# Altium schematic sheet 03 POWER.SchDoc: POWER
size 420 x 297 mm; SheetNumber: 2; SheetTotal: 7
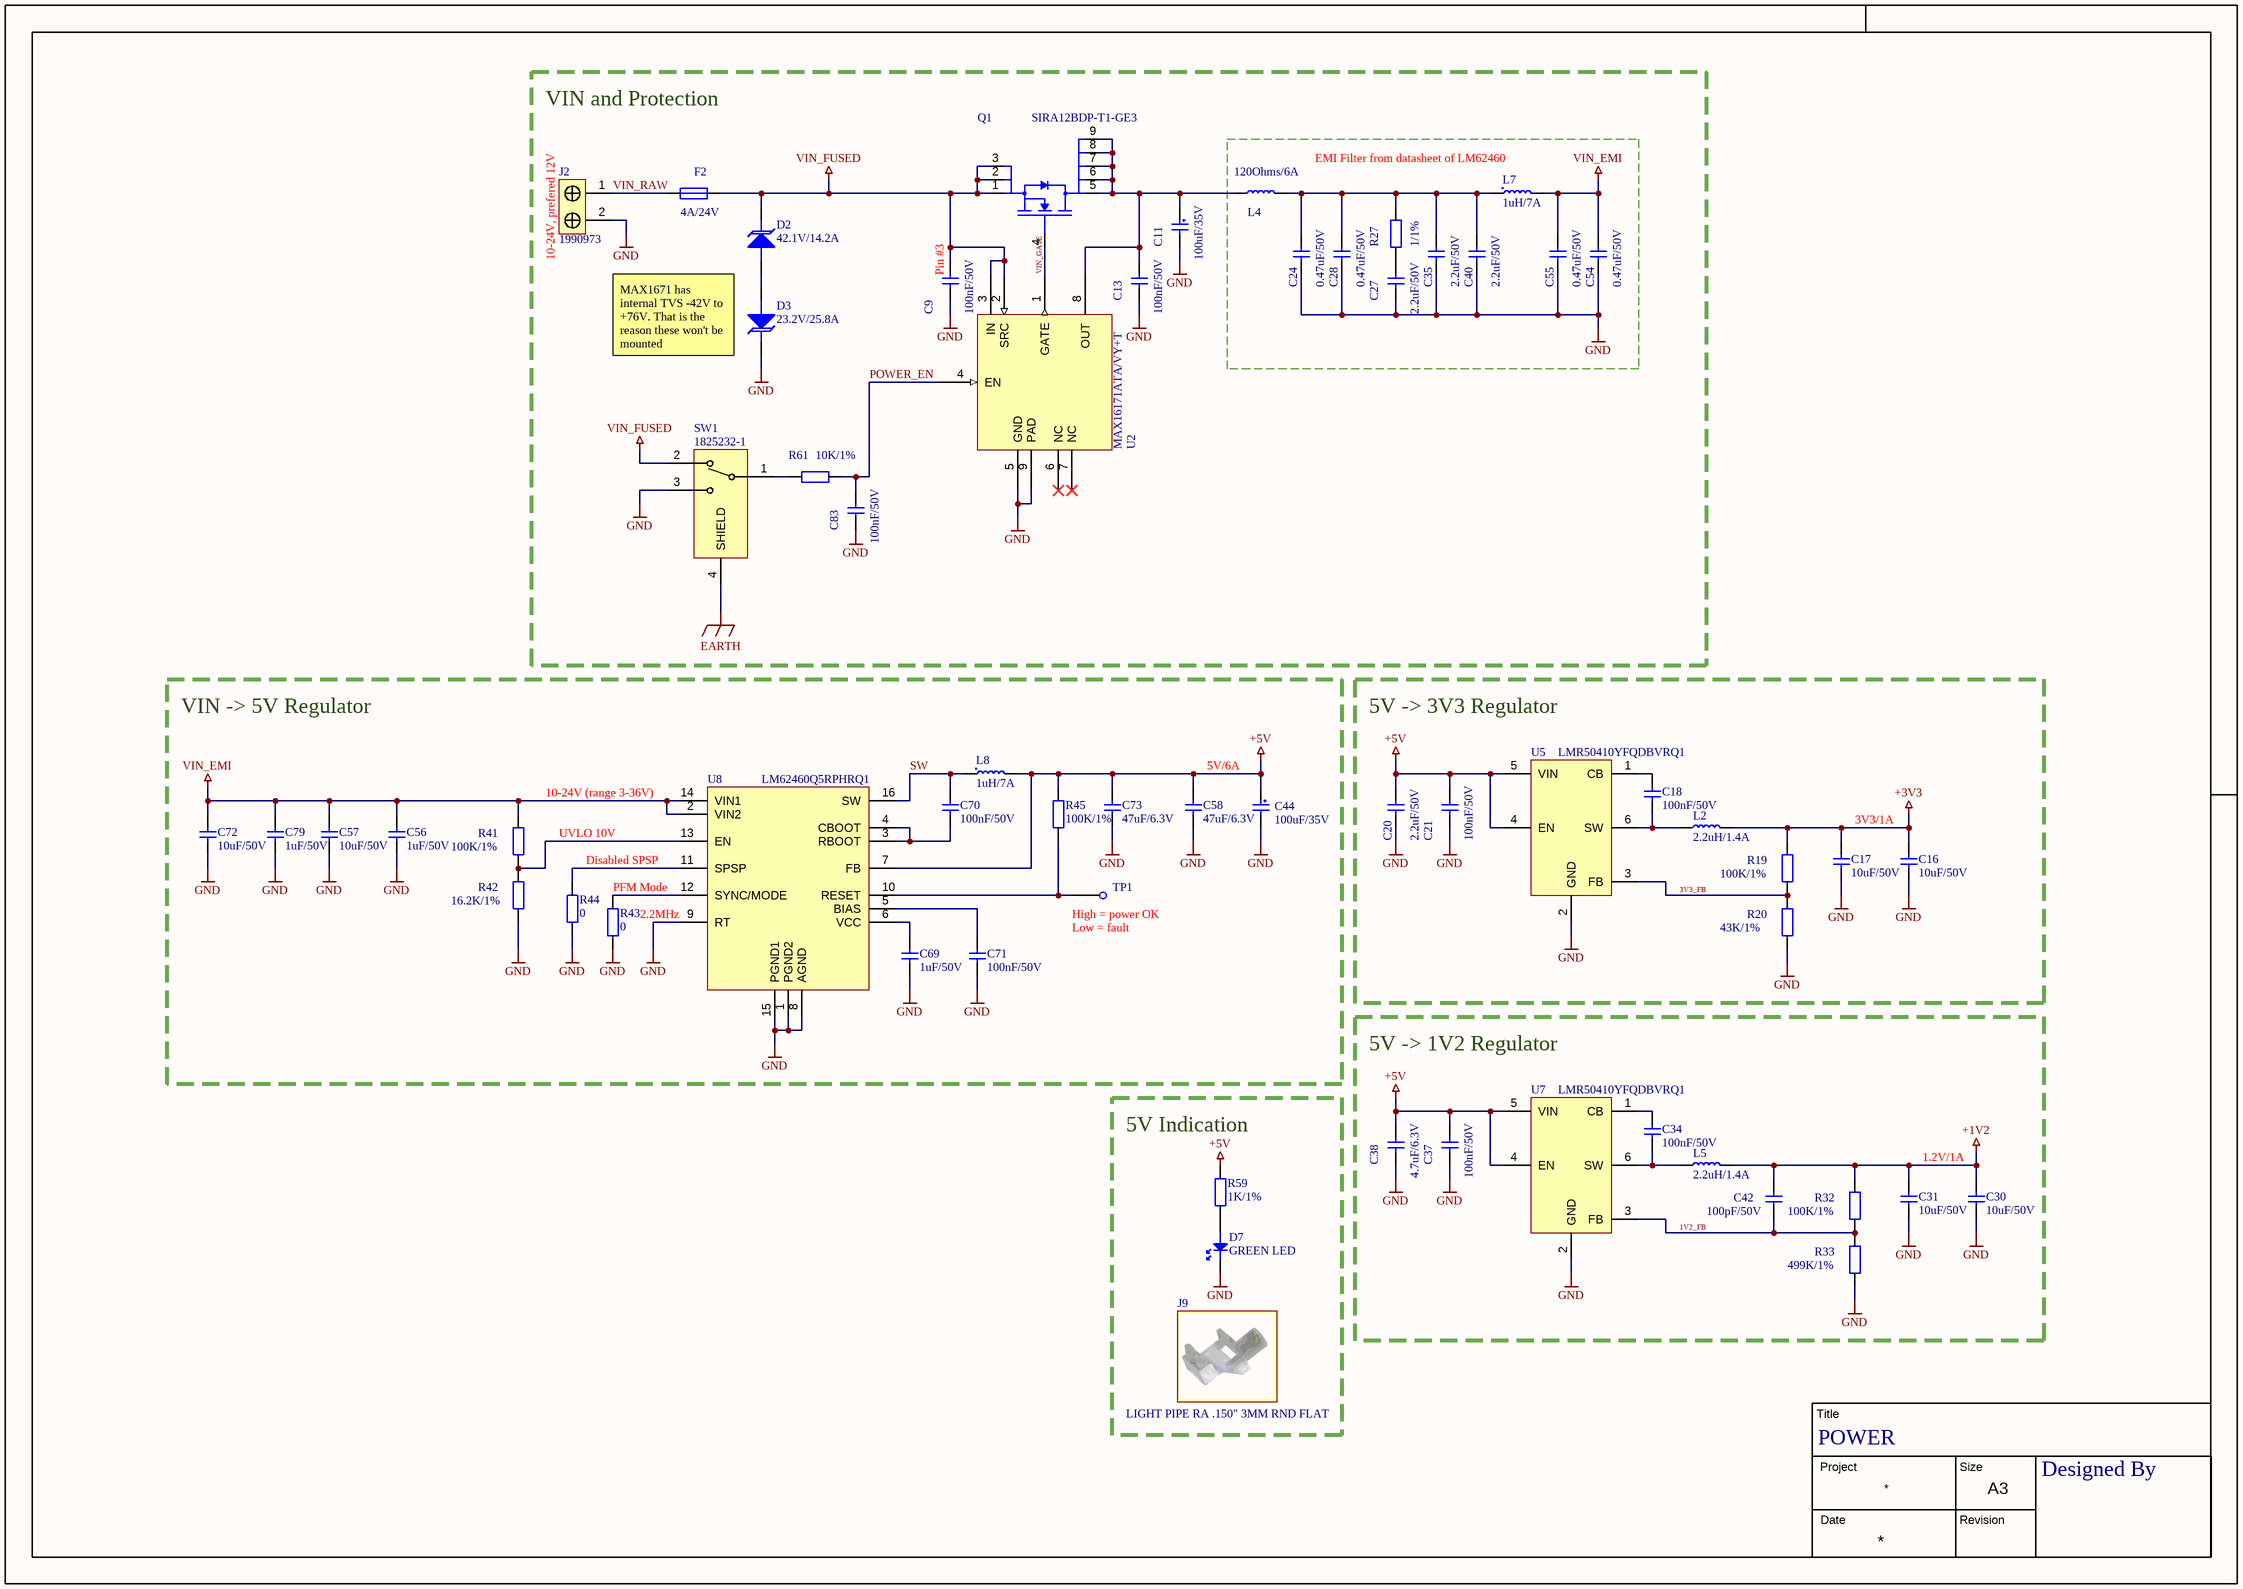
[diagram p0: 03 POWER.SchDoc]

## Parts
C9  100nF/50V  [CAPC1005X06N]
C11  100uF/35V  [CAPAE11580X70M]
C13  100nF/50V  [CAPC1005X06N]
C16  10uF/50V  [CAPC3216X18N]
C17  10uF/50V  [CAPC3216X18N]
C18  100nF/50V  [CAPC1005X06N]
C20  2.2uF/50V  [INDC1608X10N]
C21  100nF/50V  [CAPC1005X06N]
C24  0.47uF/50V  [INDC1608X10N]
C27  2.2uF/50V  [INDC1608X10N]
C28  0.47uF/50V  [INDC1608X10N]
C30  10uF/50V  [CAPC3216X18N]
C31  10uF/50V  [CAPC3216X18N]
C34  100nF/50V  [CAPC1005X06N]
C35  2.2uF/50V  [INDC1608X10N]
C37  100nF/50V  [CAPC1005X06N]
C38  4.7uF/6.3V  [CAPC1005X06N]
C40  2.2uF/50V  [INDC1608X10N]
C42  100pF/50V  [CAPC1005X06N]
C44  100uF/35V  [CAPAE11580X70M]
C54  0.47uF/50V  [INDC1608X10N]
C55  0.47uF/50V  [INDC1608X10N]
C56  1uF/50V  [INDC1608X10N]
C57  10uF/50V  [CAPC3216X18N]
C58  47uF/6.3V  [INDC1608X10N]
C69  1uF/50V  [INDC1608X10N]
C70  100nF/50V  [CAPC1005X06N]
C71  100nF/50V  [CAPC1005X06N]
C72  10uF/50V  [CAPC3216X18N]
C73  47uF/6.3V  [INDC1608X10N]
C79  1uF/50V  [INDC1608X10N]
C83  100nF/50V  [CAPC1005X06N]
D2  42.1V/14.2A  [DIOM4739X26N]
D3  23.2V/25.8A  [DIOM4739X26N]
D7  GREEN LED  [DIOC1608X06L]
F2  4A/24V  [INDC7451X08N]
J2  1990973  [1990973]
J9  LIGHT PIPE RA .150" 3MM RND FLAT  [SLP3-150-150-F]
L2  2.2uH/1.4A  [INDP2016X12N]
L4  120Ohms/6A  [INDC3216X18N]
L5  2.2uH/1.4A  [INDP2016X12N]
L7  1uH/7A  [INDP5752X20N]  (net tie)
L8  1uH/7A  [INDP5752X20N]  (net tie)
Q1  SIRA12BDP-T1-GE3  [POWERPAK-SO-8-Single]
R19  100K/1%  [RESC1005X04N]
R20  43K/1%  [RESC1005X04N]
R27  1/1%  [RESC1608X04N]
R32  100K/1%  [RESC1005X04N]
R33  499K/1%  [RESC1005X04N]
R41  100K/1%  [RESC1005X04N]
R42  16.2K/1%  [RESC1005X04N]
R43  0  [RESC1005X04N]
R44  0  [RESC1005X04N]
R45  100K/1%  [RESC1005X04N]
R59  1K/1%  [RESC1005X04N]
R61  10K/1%  [RESC1005X04N]
SW1  1825232-1  [1825232-1]
TP1  Test Point 1mm  [TEST_POINT_1mm]  (value not drawn)
U2  MAX16171ATA/VY+T  [PSON50P300X80_HS-9N]
U5  LMR50410YFQDBVRQ1  [SOT95P280X145-6N]
U7  LMR50410YFQDBVRQ1  [SOT95P280X145-6N]
U8  LM62460Q5RPHRQ1  [VQFN-HR]

## Blocks framed on the sheet
VIN and Protection: C9 C11 C13 C83 D2 D3 F2 J2 Q1 R61 SW1 U2
EMI Filter from datasheet of LM62460: C24 C27 C28 C35 C40 C54 C55 L4 L7 R27
VIN -> 5V Regulator: C44 C56-C58 C69-C73 C79 L8 R41-R45 TP1 U8
5V -> 3V3 Regulator: C16-C18 C20 C21 L2 R19 R20 U5
5V -> 1V2 Regulator: C30 C31 C34 C37 C38 C42 L5 R32 R33 U7
5V Indication: D7 J9 R59

## Nets
+1V2: C30.2 C31.2 C42.2 L5.2 R32.2
+3V3: C16.2 C17.2 L2.2 R19.2
+5V: C20.2 C21.2 C37.2 C38.2 C44.1 C58.2 C73.2 L8.2 R45.1 R59.2 U5.4(EN) U5.5(VIN) U7.4(EN) U7.5(VIN) U8.7(FB)
EARTH: SW1.4(SHIELD)
GND: C9.1 C11.2 C13.1 C16.1 C17.1 C20.1 C21.1 C24.1 C27.1 C28.1 C30.1 C31.1 C35.1 C37.1 C38.1 C40.1 C44.2 C54.1 C55.1 C56.1 C57.1 C58.1 C69.1 C71.1 C72.1 C73.1 C79.1 C83.1 D3.1 D7.1 J2.2 R20.1 R33.1 R42.1 R43.1 R44.1 SW1.3 U2.5(GND) U2.9(PAD) U5.2(GND) U7.2(GND) U8.1(PGND2) U8.8(AGND) U8.9(RT) U8.15(PGND1)
VIN_EMI: C54.2 C55.2 C56.2 C57.2 C72.2 C79.2 L7.2 R41.2 U8.2(VIN2) U8.14(VIN1)
VIN_FUSED: C9.2 D2.1 F2.2 Q1.1 Q1.2 Q1.3 SW1.2 U2.2(SRC) U2.3(IN)
1V2_FB: C42.1 R32.1 R33.2 U7.3(FB)
3V3_FB: R19.1 R20.2 U5.3(FB)
POWER_EN: C83.2 R61.2 U2.4(EN)
SW: C70.2 L8.1 U8.16(SW)
VIN_GATE: Q1.4 U2.1(GATE)
VIN_RAW: F2.1 J2.1
NetC11_1: C11.1 C13.2 L4.1 Q1.5 Q1.6 Q1.7 Q1.8 Q1.9 U2.8(OUT)
NetC18_1: C18.1 L2.1 U5.6(SW)
NetC18_2: C18.2 U5.1(CB)
NetC24_2: C24.2 C28.2 C35.2 C40.2 L4.2 L7.1 R27.2
NetC27_2: C27.2 R27.1
NetC34_1: C34.1 L5.1 U7.6(SW)
NetC34_2: C34.2 U7.1(CB)
NetC69_2: C69.2 U8.6(VCC)
NetC70_1: C70.1 U8.3(RBOOT) U8.4(CBOOT)
NetC71_2: C71.2 U8.5(BIAS)
NetD2_2: D2.2 D3.2
NetD7_2: D7.2 R59.1
NetR41_1: R41.1 R42.2 U8.13(EN)
NetR43_2: R43.2 U8.12(SYNC/MODE)
NetR44_2: R44.2 U8.11(SPSP)
NetR45_2: R45.2 TP1.1 U8.10(RESET)
NetR61_1: R61.1 SW1.1

Not connected (* = marked no-connect by the designer): U2 6(NC)* 7(NC)*

## Notes on the sheet
- (near J2) 10-24V, prefered 12V
- (near C9) Pin #3
- MAX1671 has internal TVS -42V to +76V. That is the reason these won't be mounted
- 10-24V (range 3-36V)
- 5V/6A
- UVLO 10V
- Disabled SPSP
- 3V3/1A
- (near R43) PFM Mode
- 2.2MHz
- (near TP1) High = power OK
- (near TP1) Low = fault
- 1.2V/1A
- Title
- Project
- Size
- Date
- Revision
- A3
- Designed By

## Library data of the parts
C9 C13 C18 C21 C34 C37 C70 C71 C83 = GCM155R71H104KE02J: 0.1 µF ±10% 50V Ceramic Capacitor X7R 0402 (1005 Metric); manufacturer: Murata Electronics; mfr_part_number: GCM155R71H104KE02J; assembler_number: GCM155R71H104KE02J; datasheet: https://search.murata.co.jp/Ceramy/image/img/A01X/G101/ENG/GCM155R71H104KE02-01.pdf
C11 C44 = A769KE107M1VLAS031: 100 µF 35 V Aluminum - Polymer Capacitors Radial, Can - SMD 2000 Hrs @ 125°C; manufacturer: KEMET; mfr_part_number: A769KE107M1VLAS031; assembler_number: A769KE107M1VLAS031; datasheet: https://connect.kemet.com:7667/gateway/IntelliData-ComponentDocumentation/1.0/download/datasheet/A769KE107M1VLAS031
C16 C17 C30 C31 C57 C72 = GRT31CR61H106ME01L: 10 µF ±20% 50V Ceramic Capacitor X5R 1206 (3216 Metric); manufacturer: Murata Electronics; mfr_part_number: GRT31CR61H106ME01L; assembler_number: GRT31CR61H106ME01L; datasheet: https://search.murata.co.jp/Ceramy/image/img/A01X/G101/ENG/GRT31CR61H106ME01-01.pdf
C20 C27 C35 C40 = GRT188R61H225ME13D: 2.2 µF ±20% 50V Ceramic Capacitor X5R 0603 (1608 Metric); manufacturer: Murata Electronics; mfr_part_number: GRT188R61H225ME13D; assembler_number: GRT188R61H225ME13D; datasheet: https://search.murata.co.jp/Ceramy/image/img/A01X/G101/ENG/GRT188R61H225ME13-01.pdf
C24 C28 C54 C55 = CGA3E3X7R1H474K080AB: 0.47 µF ±10% 50V Ceramic Capacitor X7R 0603 (1608 Metric); manufacturer: TDK Corporation; mfr_part_number: CGA3E3X7R1H474K080AB; assembler_number: CGA3E3X7R1H474K080AB; datasheet: https://product.tdk.com/system/files/dam/doc/product/capacitor/ceramic/mlcc/catalog/mlcc_automotive_general_en.pdf
C38 = JMK105BBJ475MVHF: 4.7 µF ±20% 6.3V Ceramic Capacitor X5R 0402 (1005 Metric); manufacturer: Taiyo Yuden; mfr_part_number: JMK105BBJ475MVHF; assembler_number: JMK105BBJ475MVHF; datasheet: https://media.digikey.com/pdf/Data%20Sheets/Taiyo%20Yuden%20PDFs%20URL%20links/JMK105BBJ475MVHF_SS.pdf
C42 = GCM1555C1H101JA16D: 100 pF ±5% 50V Ceramic Capacitor C0G, NP0 0402 (1005 Metric); manufacturer: Murata Electronics; mfr_part_number: GCM1555C1H101JA16D; assembler_number: GCM1555C1H101JA16D; datasheet: https://www.murata.com/-/media/webrenewal/support/library/catalog/products/k35e.ashx?la=en-us&cvid=20200508021757000000
C56 C69 C79 = GRT188R61H105KE13D: 1 µF ±10% 50V Ceramic Capacitor X5R 0603 (1608 Metric); manufacturer: Murata Electronics; mfr_part_number: GRT188R61H105KE13D; assembler_number: GRT188R61H105KE13D; datasheet: https://search.murata.co.jp/Ceramy/image/img/A01X/G101/ENG/GRT188R61H105KE13-01.pdf
C58 C73 = GRM188R60J476ME15D: 47 µF ±20% 6.3V Ceramic Capacitor X5R 0603 (1608 Metric); manufacturer: Murata Electronics; mfr_part_number: GRM188R60J476ME15D; assembler_number: GRM188R60J476ME15D; datasheet: https://search.murata.co.jp/Ceramy/image/img/A01X/G101/ENG/GRM188R60J476ME15-01.pdf
D2 = SMBJ26A-13-F: 42.1V Clamp 14.2A Ipp Tvs Diode Surface Mount SMB; manufacturer: Diodes Incorporated; mfr_part_number: SMBJ26A-13-F; assembler_number: SMBJ26A-13-F; datasheet: https://www.diodes.com/assets/Datasheets/ds19002.pdf
D3 = SMBJ14A-13-F: 23.2V Clamp 25.8A Ipp Tvs Diode Surface Mount SMB; manufacturer: Diodes Incorporated; mfr_part_number: SMBJ14A-13-F; assembler_number: SMBJ14A-13-F; datasheet: https://www.diodes.com/assets/Datasheets/ds19002.pdf
D7 = LTST-C191KGKT: White 0402 Light Emitting Diodes (LED) RoHS; manufacturer: Lite-On Inc.; mfr_part_number: LTST-C191KGKT; assembler_number: LTST-C191KGKT; datasheet: https://optoelectronics.liteon.com/upload/download/DS22-2000-228/LTST-C191KGKT.PDF
F2 = 0ZCF0200AF2C: Polymeric PTC Resettable Fuse 24V 2 A Ih Surface Mount 2920 (7351 Metric), Concave - 4A trip; manufacturer: Bel Fuse Inc.; mfr_part_number: 0ZCF0200AF2C; assembler_number: 0ZCF0200AF2C; datasheet: https://www.belfuse.com/resources/datasheets/circuitprotection/ds-cp-0zcf-series.pdf
J2 = 1990973: 2 Position Wire to Board Terminal Block Horizontal with Board 0.197" (5.00mm) Through Hole; manufacturer: Phoenix Contact; mfr_part_number: 1990973; assembler_number: 1990973; datasheet: https://www.phoenixcontact.com/en-pc/products/pcb-terminal-block-spt-25-2-h-50-1990973
J9 = SLP3-150-150-F: Light Pipe Single Clear Rigid Board Mount, Press Fit, Right Angle; manufacturer: Bivar Inc.; mfr_part_number: SLP3-150-150-F; assembler_number: SLP3-150-150-F; datasheet: https://www.bivar.com/parts_content/Datasheets/SLP3-150-XXX-X.pdf
L2 L5 = TYA2016102R2M-10: 2.2 µH Shielded Drum Core, Wirewound Inductor 1.4 A 180mOhm Max 0806 (2016 Metric); manufacturer: Laird-Signal Integrity Products; mfr_part_number: TYA2016102R2M-10; assembler_number: TYA2016102R2M-10; datasheet: https://www.laird.com/sites/default/files/tya201610-series-datasheet.pdf
L4 = BLM31KN121SN1L: 120 Ohms @ 100 MHz 1 Power Line Ferrite Bead 1206 (3216 Metric) 6A 9mOhm; manufacturer: Murata Electronics; mfr_part_number: BLM31KN121SN1L; assembler_number: BLM31KN121SN1L; datasheet: https://www.murata.com/en-us/products/productdata/8801529331742/ENFA0091.pdf
L7 L8 = SRP5020TA-1R0M: 1 µH Shielded Drum Core, Wirewound Inductor 7 A 20mOhm Max Nonstandard; manufacturer: Bourns Inc.; mfr_part_number: SRP5020TA-1R0M; assembler_number: SRP5020TA-1R0M; datasheet: https://www.bourns.com/docs/Product-Datasheets/SRP5020TA.pdf
Q1 = SIRA12BDP-T1-GE3: N-Channel 30 V 27A (Ta), 60A (Tc) 5W (Ta), 38W (Tc) Surface Mount PowerPAK® SO-8; manufacturer: Vishay Siliconix; mfr_part_number: SIRA12BDP-T1-GE3; assembler_number: SIRA12BDP-T1-GE3; datasheet: https://www.vishay.com/docs/76390/sira12bdp.pdf
R19 R32 R41 R45 = RMCF0402FT100K: 100 kOhms ±1% 0.063W, 1/16W Chip Resistor 0402 (1005 Metric) Automotive AEC-Q200 Thick Film; manufacturer: Stackpole Electronics Inc; mfr_part_number: RMCF0402FT100K; assembler_number: RMCF0402FT100K; datasheet: https://www.seielect.com/Catalog/SEI-RMCF_RMCP.pdf
R20 = ERJ-2RKF4302X: 43 kOhms ±1% 0.1W, 1/10W Chip Resistor 0402 (1005 Metric) Automotive AEC-Q200 Thick Film; manufacturer: Panasonic Electronic Components; mfr_part_number: ERJ-2RKF4302X; assembler_number: ERJ-2RKF4302X; datasheet: https://industrial.panasonic.com/cdbs/www-data/pdf/RDA0000/AOA0000C304.pdf
R27 = RMCF0603FT1R00: 1 Ohms ±1% 0.1W, 1/10W Chip Resistor 0603 (1608 Metric) Automotive AEC-Q200 Thick Film; manufacturer: Stackpole Electronics Inc; mfr_part_number: RMCF0603FT1R00; assembler_number: RMCF0603FT1R00; datasheet: https://www.seielect.com/Catalog/SEI-RMCF_RMCP.pdf
R33 = RMCF0402FT499K: 499 kOhms ±1% 0.063W, 1/16W Chip Resistor 0402 (1005 Metric) Automotive AEC-Q200 Thick Film; manufacturer: Stackpole Electronics Inc; mfr_part_number: RMCF0402FT499K; assembler_number: RMCF0402FT499K; datasheet: https://www.seielect.com/Catalog/SEI-RMCF_RMCP.pdf
R42 = ERJ-2RKF1622X: 16.2 kOhms ±1% 0.1W, 1/10W Chip Resistor 0402 (1005 Metric) Automotive AEC-Q200 Thick Film; manufacturer: Panasonic Electronic Components; mfr_part_number: ERJ-2RKF1622X; assembler_number: ERJ-2RKF1622X; datasheet: https://industrial.panasonic.com/cdbs/www-data/pdf/RDA0000/AOA0000C304.pdf
R43 R44 = 0402WGF0000TCE: 62.5mW Thick Film Resistors 50V ±800ppm/℃ ±1% -55℃~+155℃ 0Ω 0402  Chip Resistor - Surface Mount ROHS; manufacturer: UNI-ROYAL(Uniroyal Elec); assembler_number: C17168; mfr_part_number: 0402WGF0000TCE; datasheet: https://datasheet.lcsc.com/lcsc/2206010216_UNI-ROYAL-Uniroyal-Elec-0402WGF0000TCE_C17168.pdf
R59 = RMCF0402FT1K00: 1 kOhms ±1% 0.063W, 1/16W Chip Resistor 0402 (1005 Metric) Automotive AEC-Q200 Thick Film; manufacturer: Stackpole Electronics Inc; mfr_part_number: RMCF0402FT1K00; assembler_number: RMCF0402FT1K00; datasheet: https://www.seielect.com/Catalog/SEI-RMCF_RMCP.pdf
R61 = RMCF0402FT10K0: 10 kOhms ±1% 0.063W, 1/16W Chip Resistor 0402 (1005 Metric) Automotive AEC-Q200 Thick Film; manufacturer: Stackpole Electronics Inc; mfr_part_number: RMCF0402FT10K0; assembler_number: RMCF0402FT10K0; datasheet: https://www.seielect.com/Catalog/SEI-RMCF_RMCP.pdf
SW1 = 1825232-1: Slide Switch SPDT Through Hole, Right Angle; manufacturer: TE Connectivity ALCOSWITCH Switches; mfr_part_number: 1825232-1; assembler_number: 1825232-1; datasheet: https://www.te.com/commerce/DocumentDelivery/DDEController?Action=srchrtrv&DocNm=1825232&DocType=Customer+Drawing&DocLang=English&DocFormat=pdf&PartCntxt=1825232-1
TP1 = TestPoint
U2 = MAX16171ATA/VY+T: OR Controller N+1 ORing Controller N-Channel 1:1 8-TDFN-CU (2x3); manufacturer: Analog Devices Inc./Maxim Integrated; mfr_part_number: MAX16171ATA/VY+T; assembler_number: MAX16171ATA/VY+T; datasheet: https://datasheets.maximintegrated.com/en/ds/MAX16171.pdf
U5 U7 = LMR50410YFQDBVRQ1: Buck Switching Regulator IC Positive Adjustable 1V 1 Output 1A SOT-23-6; manufacturer: Texas Instruments; mfr_part_number: LMR50410YFQDBVRQ1; assembler_number: LMR50410YFQDBVRQ1; datasheet: https://www.ti.com/lit/ds/symlink/lmr50410-q1.pdf
U8 = LM62460Q5RPHRQ1: Switching Voltage Regulators 6-A automotive buck converter optimized for power density and low EMI; manufacturer: Texas Instruments; mfr_part_number: LM62460Q5RPHRQ1; assembler_number: LM62460Q5RPHRQ1; datasheet: https://www.ti.com/general/docs/suppproductinfo.tsp?distId=26&gotoUrl=https://www.ti.com/lit/gpn/lm62460-q1